# Altium schematic sheet Advanced Clock.SchDoc
size A3
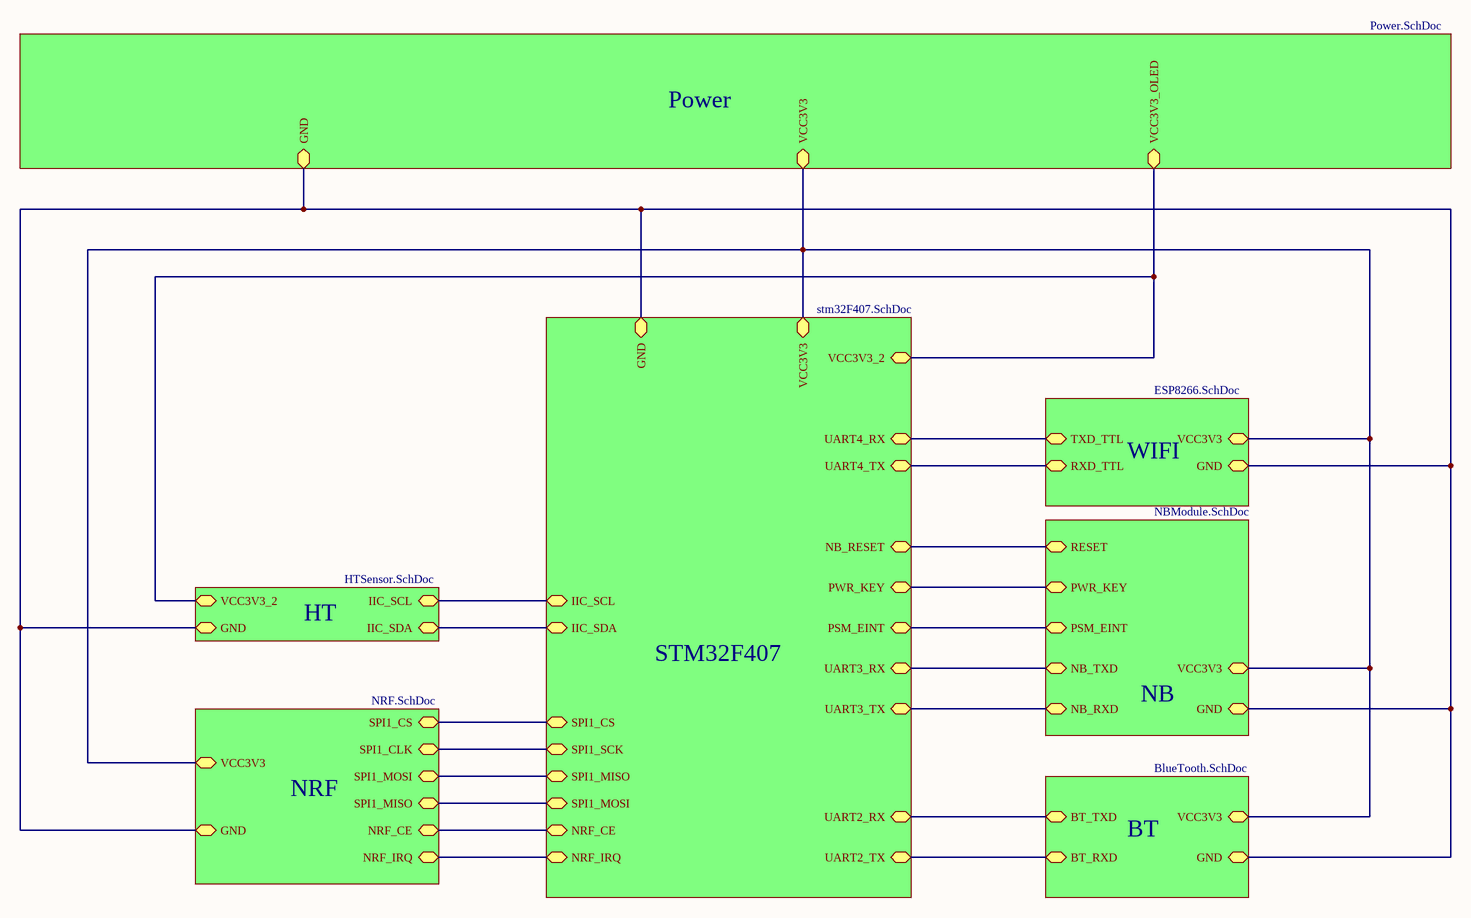
[diagram p0: Advanced Clock.SchDoc]

## Sub-sheets
BT = BlueTooth.SchDoc: BT_RXD, BT_TXD, VCC3V3, GND
HT = HTSensor.SchDoc: IIC_SCL, IIC_SDA, VCC3V3_2, GND
NB = NBModule.SchDoc: NB_TXD, NB_RXD, VCC3V3, GND, PSM_EINT, PWR_KEY, RESET
NRF = NRF.SchDoc: SPI1_CS, SPI1_CLK, SPI1_MOSI, SPI1_MISO, NRF_CE, NRF_IRQ, VCC3V3, GND
Power = Power.SchDoc: GND, VCC3V3, VCC3V3_OLED
STM32F407 = stm32F407.SchDoc: IIC_SCL, IIC_SDA, SPI1_CS, SPI1_SCK, SPI1_MISO, SPI1_MOSI, NRF_CE, NRF_IRQ, UART2_TX, UART2_RX, UART3_RX, UART3_TX, UART4_RX, UART4_TX, GND, VCC3V3_2, VCC3V3, NB_RESET, PWR_KEY, PSM_EINT
WIFI = ESP8266.SchDoc: TXD_TTL, RXD_TTL, VCC3V3, GND

## Nets
(unnamed): sheet STM32F407/IIC_SCL, sheet HT/IIC_SCL
(unnamed): sheet STM32F407/IIC_SDA, sheet HT/IIC_SDA
(unnamed): sheet STM32F407/SPI1_CS, sheet NRF/SPI1_CS
(unnamed): sheet STM32F407/SPI1_SCK, sheet NRF/SPI1_CLK
(unnamed): sheet STM32F407/SPI1_MISO, sheet NRF/SPI1_MOSI
(unnamed): sheet STM32F407/SPI1_MOSI, sheet NRF/SPI1_MISO
(unnamed): sheet STM32F407/NRF_CE, sheet NRF/NRF_CE
(unnamed): sheet STM32F407/NRF_IRQ, sheet NRF/NRF_IRQ
(unnamed): sheet STM32F407/UART2_TX, sheet BT/BT_RXD
(unnamed): sheet STM32F407/UART2_RX, sheet BT/BT_TXD
(unnamed): sheet STM32F407/UART3_RX, sheet NB/NB_TXD
(unnamed): sheet STM32F407/UART3_TX, sheet NB/NB_RXD
(unnamed): sheet STM32F407/UART4_RX, sheet WIFI/TXD_TTL
(unnamed): sheet STM32F407/UART4_TX, sheet WIFI/RXD_TTL
(unnamed): sheet STM32F407/GND, sheet NB/GND, sheet BT/GND, sheet WIFI/GND, sheet HT/GND, sheet NRF/GND, sheet Power/GND
(unnamed): sheet STM32F407/VCC3V3_2, sheet HT/VCC3V3_2, sheet Power/VCC3V3_OLED
(unnamed): sheet STM32F407/VCC3V3, sheet NB/VCC3V3, sheet BT/VCC3V3, sheet WIFI/VCC3V3, sheet NRF/VCC3V3, sheet Power/VCC3V3
(unnamed): sheet STM32F407/NB_RESET, sheet NB/RESET
(unnamed): sheet STM32F407/PWR_KEY, sheet NB/PWR_KEY
(unnamed): sheet STM32F407/PSM_EINT, sheet NB/PSM_EINT